# EAGLE design Nixie HV PSU MAX1771 (EAGLE 4.91)
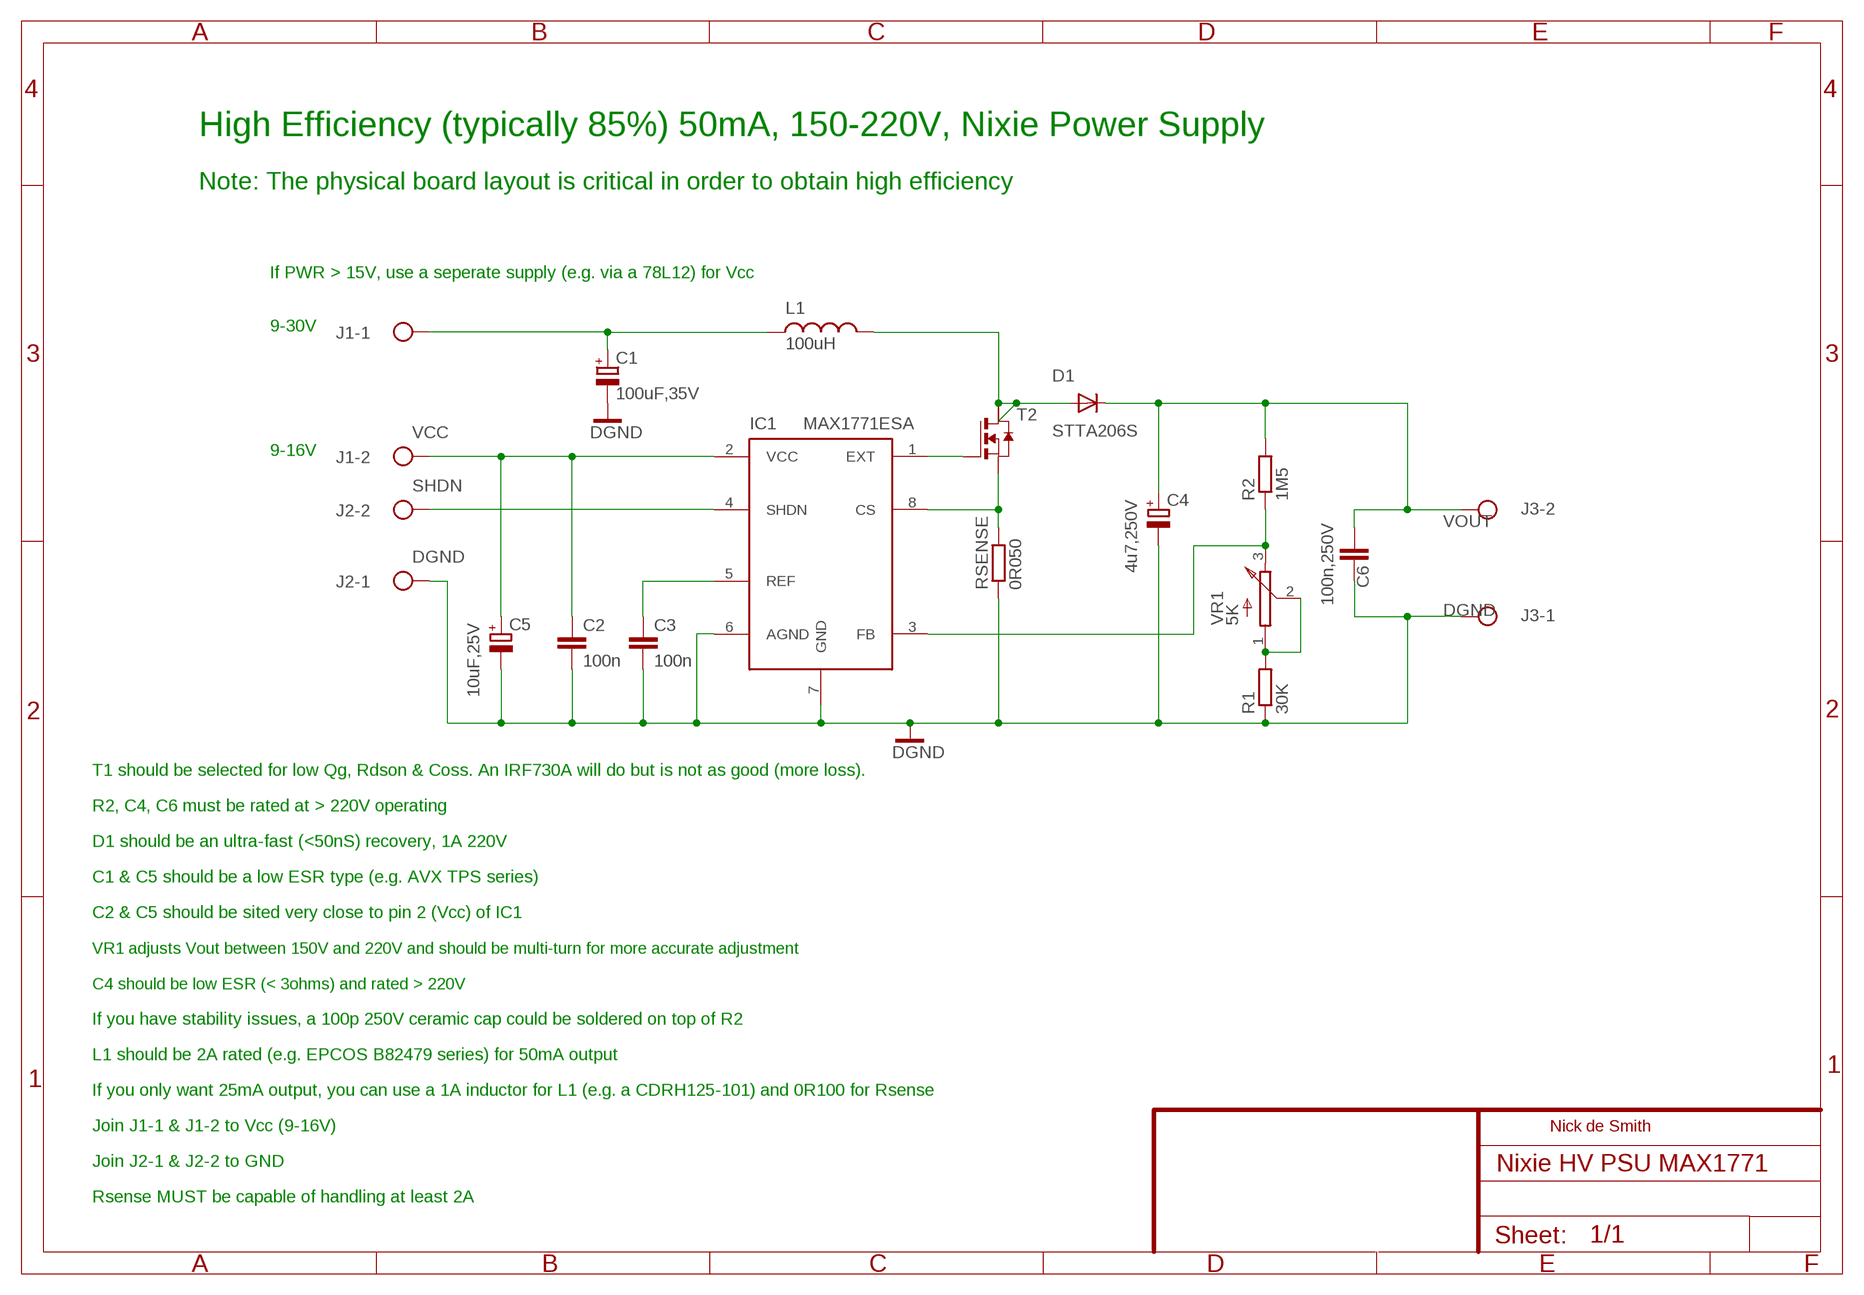
[diagram p0: schematic, sheet 1]

## Parts
C1  100uF,35V  C-POL-EU7343  [C-EIA-7343]
C2  100n  C-EUC0805  [C0805]
C3  100n  C-EUC0805  [C0805]
C4  4u7,250V  C-POL-EU-NICHICON-UJ-12  [NICHICON-UJ-12]
C5  10uF,25V  C-POL-EU7343  [C-EIA-7343]
C6  100n,250V  C-EU-2420  [C2420]
D1  STTA206S  DIODE-SMC  [SMC]
IC1  MAX1771ESA  [SO-8]
J1  TERM-BLOCK-2-02IN  [SCREW-2-02]
J2  TERM-BLOCK-2-02IN  [SCREW-2-02]
J3  TERM-BLOCK-2-02IN  [SCREW-2-02]
L1  100uH  L-SMT-POWER-B82479  [L-B82479]
R1  30K  R-EU_R0805  [R0805]
R2  1M5  R-EU_R2512  [R2512]
RSENSE  0R050  R-EU_R2010  [R2010]
T2  NMOSSOT223  [SOT223]
VR1  5K  TRIMPOT-3214W  [BOURNS-3214W]

## Nets
DGND [power]: C1.- C2.2 C3.2 C4.1(-) C5.- C6.P$2 IC1.6(AGND) IC1.7(GND) J2.1 J3.1 R1.1 RSENSE.1
EXT: IC1.1(EXT) T2.1(G)
N$2: IC1.8(CS) RSENSE.2 T2.3(S)
N$3: R1.2 VR1.1(A) VR1.2(W)
N$8: IC1.3(FB) R2.1 VR1.3(B)
N$15 [power]: D1.A L1.P$2 T2.2(D) T2.4(D2)
N$17: C3.1 IC1.5(REF)
PWR [power]: C1.+ J1.1 L1.P$1
SHDN: IC1.4(SHDN) J2.2
VCC [power]: C2.1 C5.+ IC1.2(VCC) J1.2
VOUT [power]: C4.2(+) C6.P$1 D1.C J3.2 R2.2

## Notes on the sheet
- High Efficiency (typically 85%) 50mA, 150-220V, Nixie Power Supply
- Note: The physical board layout is critical in order to obtain high efficiency
- If PWR > 15V, use a seperate supply (e.g. via a 78L12) for Vcc
- 9-30V
- 9-16V
- T1 should be selected for low Qg, Rdson & Coss. An IRF730A will do but is not as good (more loss).
- R2, C4, C6 must be rated at > 220V operating
- D1 should be an ultra-fast (<50nS) recovery, 1A 220V
- C1 & C5 should be a low ESR type (e.g. AVX TPS series)
- C2 & C5 should be sited very close to pin 2 (Vcc) of IC1
- VR1 adjusts Vout between 150V and 220V and should be multi-turn for more accurate adjustment
- C4 should be low ESR (< 3ohms) and rated > 220V
- If you have stability issues, a 100p 250V ceramic cap could be soldered on top of R2
- L1 should be 2A rated (e.g. EPCOS B82479 series) for 50mA output
- If you only want 25mA output, you can use a 1A inductor for L1 (e.g. a CDRH125-101) and 0R100 for Rsense
- Join J1-1 & J1-2 to Vcc (9-16V) | Nick de Smith
- Join J2-1 & J2-2 to GND
- Rsense MUST be capable of handling at least 2A

## Library data of the parts
C1 C5 = nick:C-POL-EU7343: Capacitor, Tantalum, EU 7343 case, polarised
C2 C3 = rcl:C-EU: CAPACITOR, European symbol
C4 = nick:C-POL-EU: Capacitor, Tantalum, EU 7343 case, polarised
C6 = nick:C-EU
D1 = diode:DIODE-: DIODE
IC1 = nick:MAX1771
J1-J3 = nick:TERM-BLOCK-2
L1 = nick:L-SMT-POWER: SMT power inductors
R1 R2 RSENSE = rcl:R-EU_: RESISTOR, European symbol
T2 = zetex:NMOSSOT223: MOS FET
VR1 = nick:TRIMPOT

## Net classes
1 power: width 0.762 mm, clearance 0.508 mm

## Board
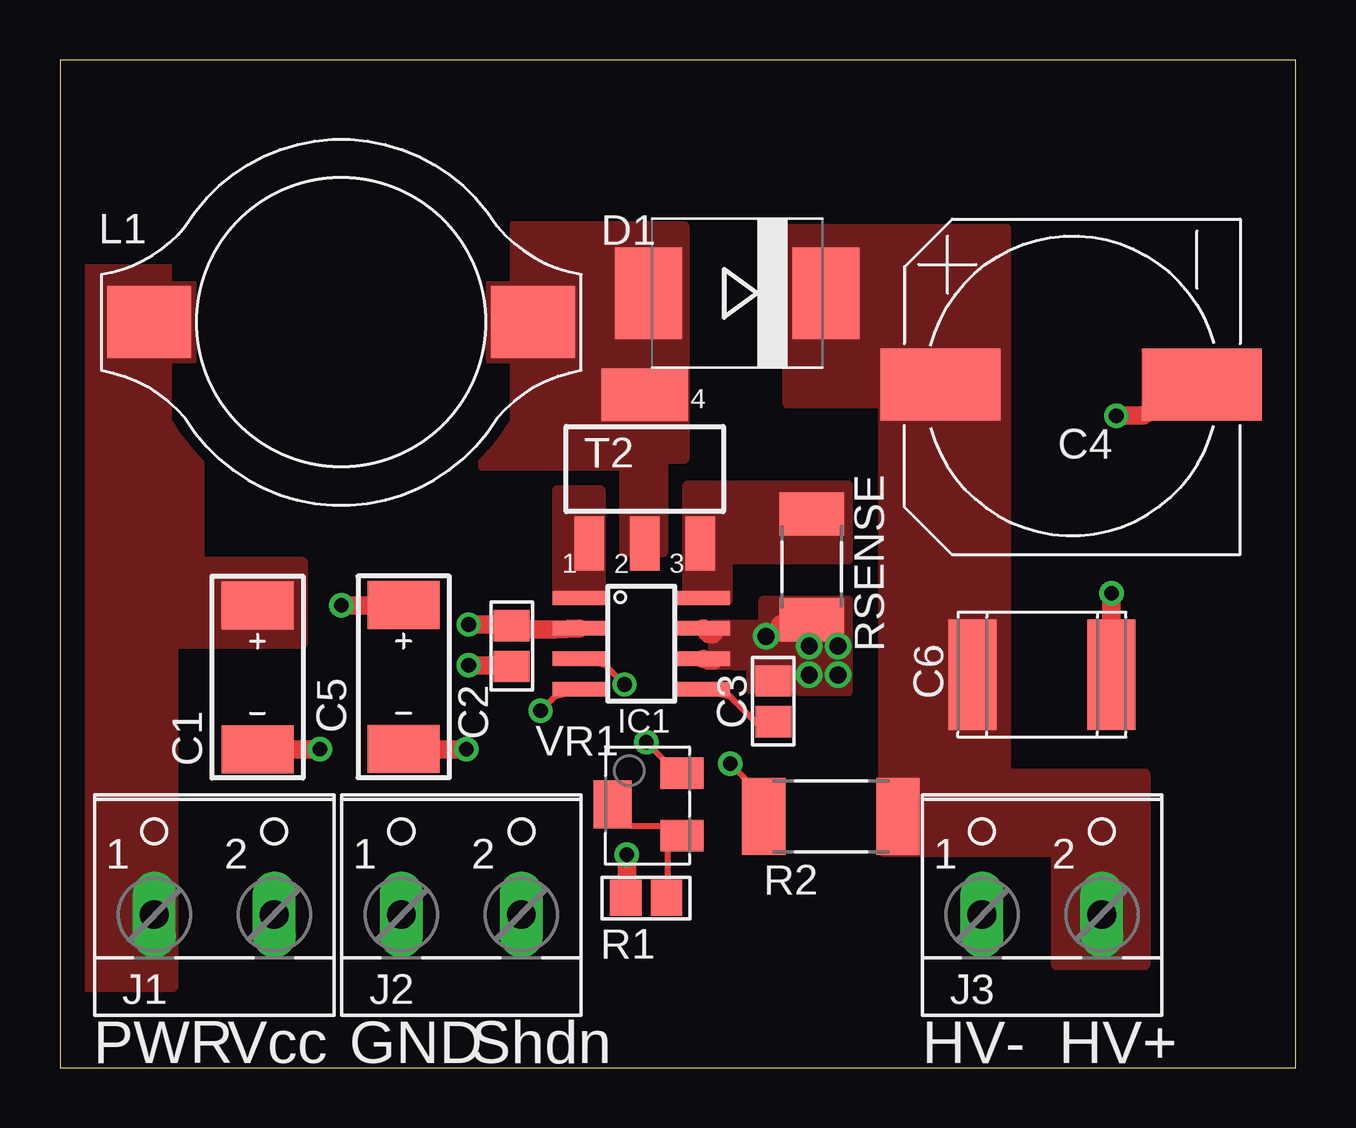
[diagram p1: board, top side]
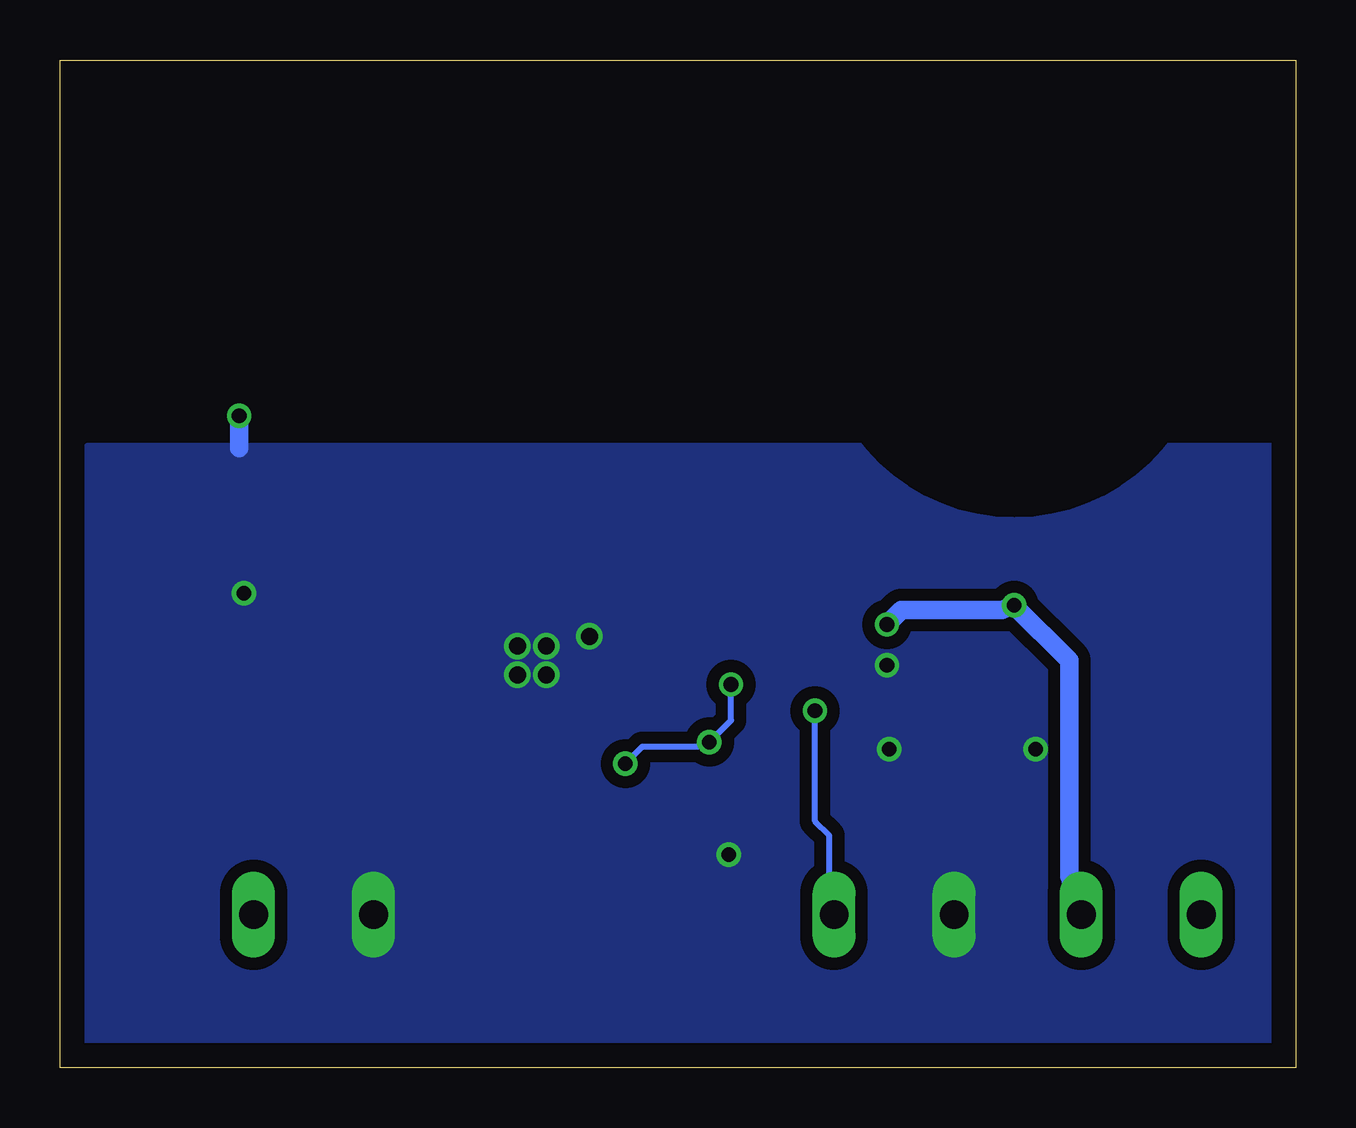
[diagram p2: board, bottom side, seen from below]

Size 51.5 x 42 mm. Coordinates in mm from the lower left corner, seen from the top.
Outline: 0,0 51.5,0 51.5,42 0,42 0,0
Copper layers (1*16): Top 0.035mm / dielectric 1.5mm / Bottom 0.035mm
Design rules "10mils": minimum track width 10mil, minimum drill 24mil, track to track 10mil, track to pad 10mil, pad to pad 10mil, via to via 10mil, smd to smd 10mil, copper to edge 40mil, drill to drill 10mil, minimum pad ring 10mil, minimum via ring 8mil, stop-mask expansion 0mil, vias tented up to drill 0mil, thermal gap 10mil

### Footprints (pad centres in the part's own frame; a part is rotated, then mirrored left to right if it is on the bottom)
C-EIA-7343 = smd 2 x 3: + -3,0; - 3,0
C0805 = smd 1.3 x 1.5: 1 -0.85,0; 2 0.85,0
NICHICON-UJ-12 = smd 3 x 5: 1 -2.4,-7.6; 2 -2.4,3.3
C2420 = smd 2 x 4.6: P$1 2.9,0; P$2 -2.9,0
SMC = smd 2.8 x 3.8: A 3.7,0; C -3.7,0
SO-8 = smd 0.6 x 2.2: 1 -1.905,-2.6; 2 -0.635,-2.6; 3 0.635,-2.6; 4 1.905,-2.6; 5 1.905,2.6; 6 0.635,2.6; 7 -0.635,2.6; 8 -1.905,2.6
SCREW-2-02 = drill 1.194 long: 1 -2.5,0; 2 2.5,0
L-B82479 = smd 3.5 x 3: P$1 -8,0; P$2 8,0
R0805 = smd 1.3 x 1.5: 1 -0.85,0; 2 0.85,0
R2512 = smd 1.8 x 3.2: 1 -2.8,0; 2 2.8,0
R2010 = smd 1.8 x 2.7: 1 -2.2,0; 2 2.2,0
SOT223 = smd 1.219 x 2.235: 1 -2.311,-3.099; 2 0,-3.099; 3 2.311,-3.099 | smd 3.6 x 2.2: 4 0,3.099
BOURNS-3214W = smd 1.8 x 1.3: 1 1.4,-1.3; 3 1.4,1.3 | smd 1.6 x 2: 2 -1.5,0

### Placement (x,y rotation side)
C1  8.23,16.27 270 top
C2  18.83,17.57 270 top
C3  29.73,15.27 90 top
C4  39.99,30.87 90 top
C5  14.32,16.28 270 top
C6  40.93,16.37 180 top
D1  28.23,32.27 180 top
IC1  24.23,17.67 270 top
J1  6.43,6.37 0 top
J2  16.73,6.37 0 top
J3  40.93,6.37 0 top
L1  11.72,31.07 0 top
R1  24.43,7.07 0 top
R2  32.13,10.47 0 top
RSENSE  31.33,20.87 90 top
T2  24.38,24.95 0 top
VR1  24.53,10.97 0 top

### Tracks (layer width: path | path; a pad name or v marks a point on that pad's centre or on a via)
DGND  (via drill 0.61, 0.7)
  Top 0.762: v23.63,8.87 23.63,7.77 R1.1 | v17.03,16.77 18.13,16.77 C2.2 | IC1.6 27.03,16.97 27.23,16.97 | IC1.7 27.03,18.07 27.23,18.07 | 30.03,18.47 RSENSE.1 | v10.83,13.27 9.73,13.27 C1.- | v16.93,13.27 15.73,13.27 C5.- | v43.83,19.77 43.83,18.67 C6.P$2 | v44.03,27.17 45.13,27.17 C4.1
  Bottom 0.762: 44.03,25.83 v44.03,27.17
  other vias: 29.43,17.97 31.23,17.57 32.43,17.57 32.43,16.37 31.23,16.37
  pour Bottom (isolate 0.01, rank 3, no thermals): 0.43,25.83 50.33,25.83 50.33,0.57 0.43,0.57
  pour Top (no thermals): 27.23,16.77 27.23,18.47 29.33,18.47 29.33,19.47 32.83,19.47 32.83,15.67 28.83,15.67 28.83,16.77
EXT
  pour Top (no thermals): 20.73,24.07 22.53,24.07 22.53,19.47 20.73,19.47
N$2
  pour Top (no thermals): 26.16,19.47 26.16,24.27 32.83,24.27 32.83,21.17 27.83,21.17 27.83,19.47
N$3
  Top 0.254: R1.2 25.33,7.77 25.33,9.07 VR1.1 25.13,10.07 23.83,10.07 VR1.2
N$8  (via drill 0.61)
  Top 0.254: v23.53,15.97 22.73,16.77 IC1.3 | v24.43,13.57 25.13,12.87 VR1.3 | v27.93,12.67 28.53,12.07 R2.1
  Bottom 0.254: v23.53,15.97 23.53,14.47 v24.43,13.57 24.93,13.37 27.23,13.37 v27.93,12.67
N$15
  pour Top (no thermals): 17.63,35.07 26.03,35.07 26.03,25.37 25.13,25.37 25.13,21.47 23.53,21.47 23.53,25.07 17.63,25.07
N$17
  Top 0.254: IC1.5 27.93,15.47 29.03,14.37 C3.1
PWR
  pour Top (isolate 0.01, rank 2, no thermals): 4.73,17.67 10.13,17.67 10.13,21.07 5.83,21.07 5.83,33.27 0.83,33.27 0.83,3.37 4.73,3.37
SHDN  (via drill 0.61)
  Top 0.254: v20.03,14.87 20.63,15.47 IC1.4
  Bottom 0.254: v20.03,14.87 20.03,10.27 19.43,9.67 19.43,8.07 J2.2
VCC  (via drill 0.61)
  Top 0.762: IC1.2 20.63,18.27 19.53,18.27 C2.1 18.13,18.47 v17.03,18.47 | v11.73,19.27 12.83,19.27 C5.+
  Bottom 0.762: J1.2 9.43,7.97 9.43,16.97 v11.73,19.27 12.23,19.07 16.43,19.07 v17.03,18.47
VOUT
  pour Top (isolate 0.01, rank 2, no thermals): 30.33,34.97 39.43,34.97 39.43,12.27 45.23,12.27 45.23,4.27 41.53,4.27 41.53,8.97 34.33,8.97 34.33,27.67 30.33,27.67

### Text on the board
tPlace: PWR | Vcc | GND | Shdn | HV- | HV+